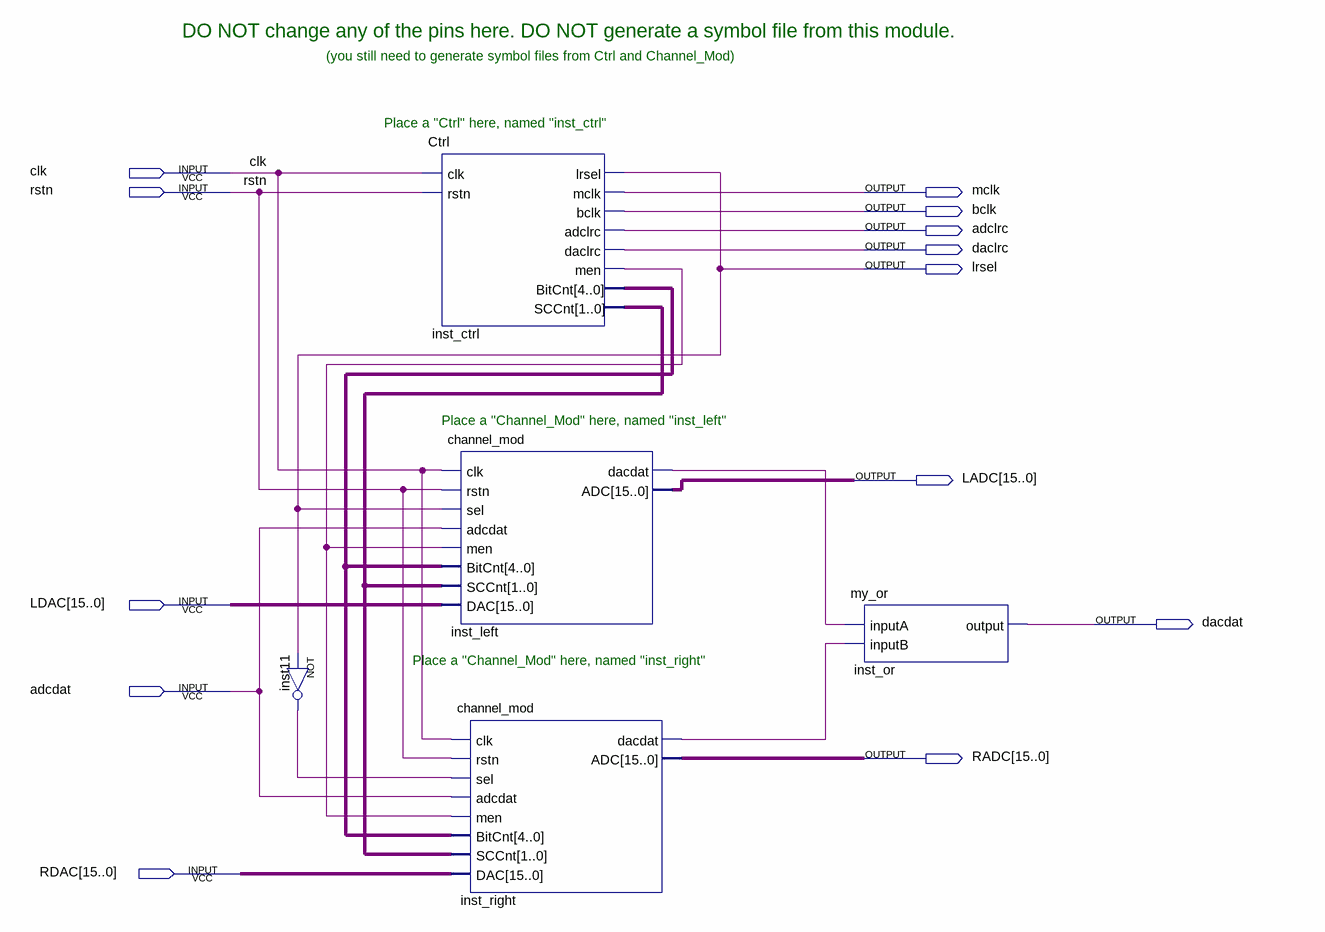
[diagram p0: schematic sheet]
// Quartus schematic SndDriver.bdf as structural Verilog: 5 symbols, 13 pins
module SndDriver (
  input  clk,
  input  rstn,
  input  [15:0] LDAC,
  input  adcdat,
  input  [15:0] RDAC,
  output mclk,
  output bclk,
  output adclrc,
  output daclrc,
  output lrsel,
  output [15:0] LADC,
  output dacdat,
  output [15:0] RADC
);

  wire inst11_out, inst_ctrl_men, inst_left_dacdat, inst_right_dacdat;
  wire [1:0] inst_ctrl_sccnt;
  wire [4:0] inst_ctrl_bitcnt;

  not inst11 (inst11_out, lrsel);
  Ctrl inst_ctrl (
    .clk(clk), .rstn(rstn), .lrsel(lrsel), .mclk(mclk), .bclk(bclk), .adclrc(adclrc), .daclrc(daclrc),
    .men(inst_ctrl_men), .BitCnt(inst_ctrl_bitcnt), .SCCnt(inst_ctrl_sccnt));
  channel_mod inst_left (
    .clk(clk), .rstn(rstn), .sel(lrsel), .adcdat(adcdat), .men(inst_ctrl_men), .BitCnt(inst_ctrl_bitcnt),
    .SCCnt(inst_ctrl_sccnt), .DAC(LDAC), .dacdat(inst_left_dacdat), .ADC(LADC));
  channel_mod inst_right (
    .clk(clk), .rstn(rstn), .sel(inst11_out), .adcdat(adcdat), .men(inst_ctrl_men),
    .BitCnt(inst_ctrl_bitcnt), .SCCnt(inst_ctrl_sccnt), .DAC(RDAC), .dacdat(inst_right_dacdat), .ADC(RADC));
  my_or inst_or (.inputA(inst_left_dacdat), .inputB(inst_right_dacdat), .\output (dacdat));

  // Notes on the sheet:
  //   DO NOT change any of the pins here. DO NOT generate a symbol file from this module.
  //   (you still need to generate symbol files from Ctrl and Channel_Mod)
  //   Place a "Ctrl" here, named "inst_ctrl"
  //   Place a "Channel_Mod" here, named "inst_left"
  //   Place a "Channel_Mod" here, named "inst_right"
endmodule
